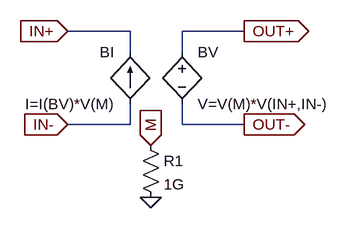
[diagram p0: schematic DCtransformer2.asc]
DCtransformer2.asc, the LTspice schematic file:
Version 4
SHEET 1 880 680
WIRE 48 64 -48 64
WIRE 224 64 128 64
WIRE 48 96 48 64
WIRE 128 96 128 64
WIRE 48 208 48 176
WIRE 48 208 -48 208
WIRE 128 208 128 176
WIRE 224 208 128 208
FLAG -48 64 IN+
IOPIN -48 64 In
FLAG -48 208 IN-
IOPIN -48 208 In
FLAG 224 64 OUT+
IOPIN 224 64 Out
FLAG 224 208 OUT-
IOPIN 224 208 Out
FLAG 80 240 M
IOPIN 80 240 In
FLAG 80 320 0
SYMBOL bv 128 80 R0
SYMATTR InstName BV
SYMATTR Value V=V(M)*V(IN+,IN-)
SYMBOL bi 48 176 R180
WINDOW 0 24 80 Left 2
WINDOW 3 24 0 Left 2
SYMATTR InstName BI
SYMATTR Value I=I(BV)*V(M)
SYMBOL res 64 224 R0
SYMATTR InstName R1
SYMATTR Value 1G

The netlist it stands for:
* DCtransformer2.asc
BV OUT+ OUT- V=V(M)*V(IN+,IN-)
BI IN- IN+ I=I(BV)*V(M)
R1 M 0 1G
.backanno
.end